# Altium schematic sheet 8161芯片-FSK调试板V1.28.SchDoc
size A4
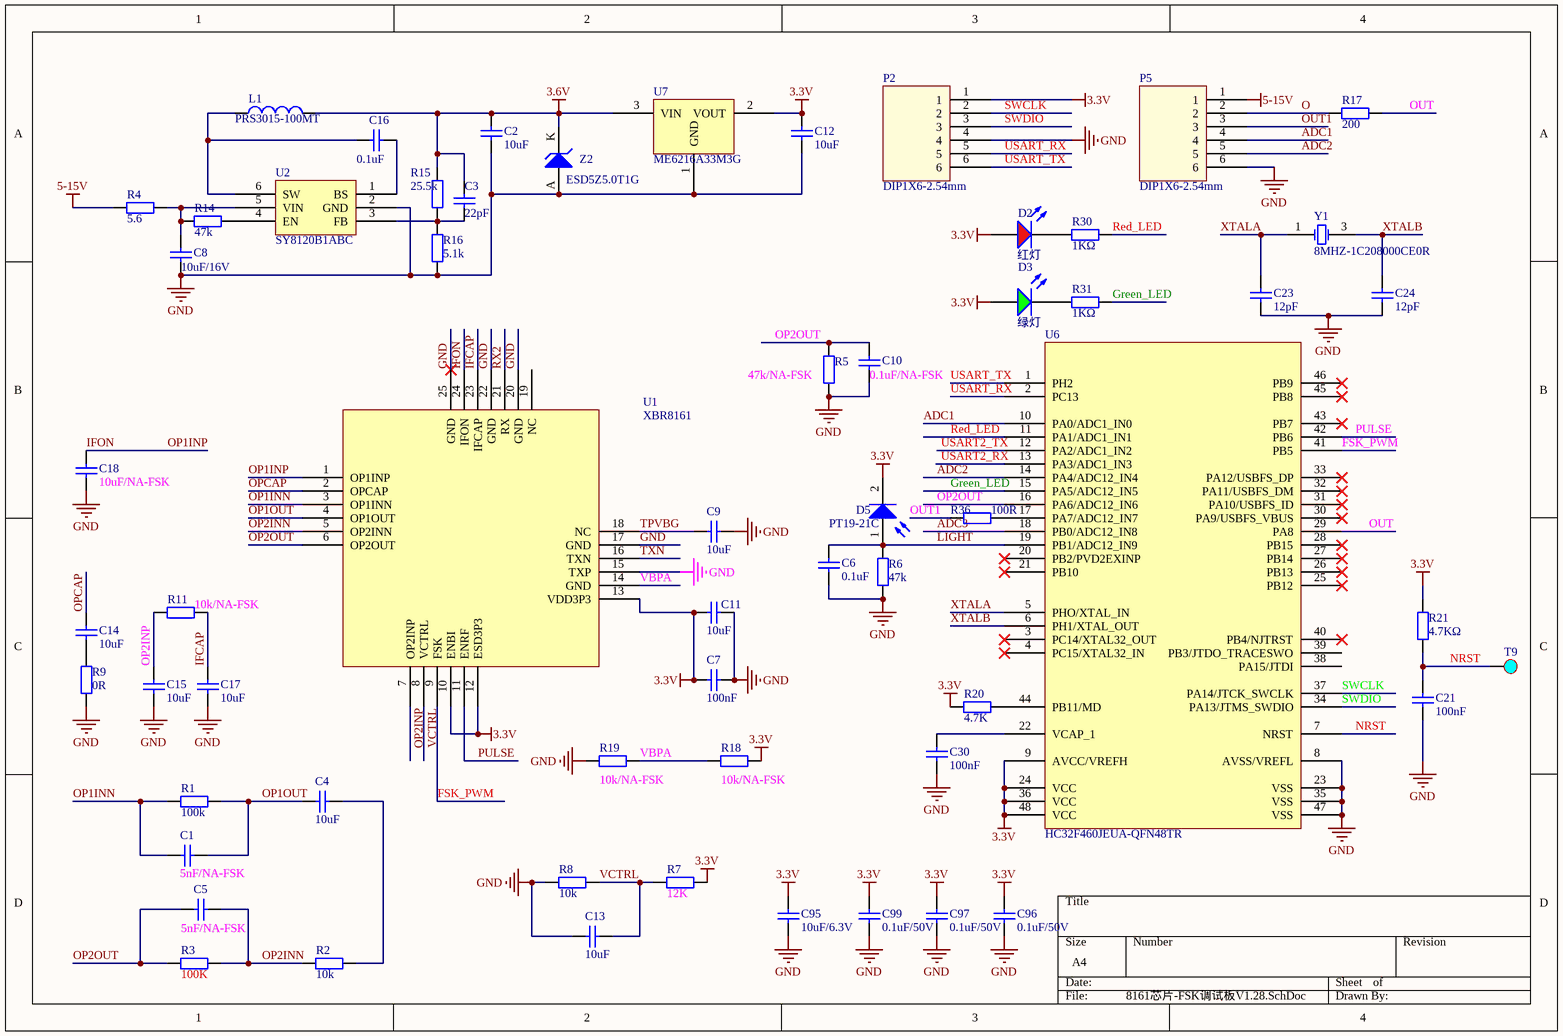
[diagram p0: 8161芯片-FSK调试板V1.28.SchDoc]

## Parts
C1  5nF/NA-FSK  [C0402]
C2  10uF  [C0402]
C3  22pF  [C0402]
C4  10uF  [C0402]
C5  5nF/NA-FSK  [C0402]
C6  0.1uF  [C0402]
C7  100nF  [C0402]
C8  10uF/16V  [C0603]
C9  10uF  [C0402]
C10  0.1uF/NA-FSK  [C0402]
C11  10uF  [C0402]
C12  10uF  [C0402]
C13  10uF  [C0402]
C14  10uF  [C0402]
C15  10uF  [C0402]
C16  0.1uF  [C0402]
C17  10uF  [C0402]
C18  10uF/NA-FSK  [C0402]
C21  100nF  [C0402]
C23  12pF  [C0402]
C24  12pF  [C0402]
C30  100nF  [C0402]
C95  10uF/6.3V  [C0402]
C96  0.1uF/50V  [C0402]
C97  0.1uF/50V  [C0402]
C99  0.1uF/50V  [C0402]
D2  红灯  [LC-0603_LED_S1]
D3  绿灯  [LC-0603_LED_S1]
D5  PT19-21C  [LED-0603]
L1  PRS3015-100MT  [PRS3015]
P2  DIP1X6-2.54mm  [DIP1X6-2.54]
P5  DIP1X6-2.54mm  [DIP1X6-2.54]
R1  100k  [R0402]
R2  10k  [R0402]
R3  100K  [R0402]
R4  5.6  [R0402]
R5  47k/NA-FSK  [R0402]
R6  47k  [R0402]
R7  12K  [R0402]
R8  10k  [R0402]
R9  0R  [R0402]
R11  10k/NA-FSK  [R0402]
R14  47k  [R0402]
R15  25.5k  [R0402]
R16  5.1k  [R0402]
R17  200  [R0402]
R18  10k/NA-FSK  [R0402]
R19  10k/NA-FSK  [R0402]
R20  4.7K  [R0402]
R21  4.7KΩ  [R0402]
R30  1KΩ  [R0402]
R31  1KΩ  [R0402]
R36  100R  [R0402]
T9  (no value)  [TestPoints]
U1  XBR8161  [QFN24]
U2  SY8120B1ABC  [SOT-23-6]
U6  HC32F460JEUA-QFN48TR  [QFN48-5X5mm]
U7  ME6216A33M3G  [SOT-23-L]
Y1  8MHZ-1C208000CE0R  [OSC-SMD_3225]
Z2  ESD5Z5.0T1G  [SOD323]

## Nets
3.3V: C7.2 C11.2 C12.1 C95.1 C96.1 C97.1 C99.1 D2.A D3.A D5.2(K) P2.1 R7.1 R18.1 R20.1 R21.2 U1.10(ENBI) U1.12(ESD3P3) U1.13(VDD3P3) U6.9(AVCC/VREFH) U6.24(VCC) U6.36(VCC) U6.48(VCC) U7.2(VOUT)
3.6V: C2.1 C3.2 L1.2 R15.2 U7.3(VIN) Z2.K
5-15V: P5.1 R4.1
GND: C2.2 C6.2 C7.1 C8.2 C9.1 C10.2 C11.1 C12.2 C13.2 C15.2 C17.1 C18.1 C21.1 C23.1 C24.1 C30.2 C95.2 C96.2 C97.2 C99.2 P2.4 P5.6 R5.2 R6.2 R8.2 R9.2 R16.1 R19.2 U1.15(TXP) U1.17(GND) U1.20(GND) U1.22(GND) U1.25(GND) U2.2(GND) U6.8(AVSS/VREFL) U6.23(VSS) U6.35(VSS) U6.47(VSS) U7.1(GND) Z2.A
ADC1: P5.4 U6.10(PA0/ADC1_IN0)
ADC2: P5.5 U6.14(PA4/ADC12_IN4)
ADC3: U6.18(PB0/ADC12_IN8)
FSK_PWM: U1.9(FSK) U6.41(PB5)
Green_LED: R31.1 U6.15(PA5/ADC12_IN5)
IFCAP: C17.2 R11.1 U1.23(IFCAP)
IFON: C18.2 U1.1(OP1INP) U1.24(IFON)  [also labelled OP1INP]
LIGHT: C6.1 D5.1(A) R6.1 U6.19(PB1/ADC12_IN9)
NRST: C21.2 R21.1 T9.1 U6.7(NRST)
O: P5.2 R17.1
OP1INN: C1.2 R1.1 U1.3(OP1INN)
OP1OUT: C1.1 C4.2 R1.2 U1.4(OP1OUT)
OP2INN: C5.2 R2.2 R3.1 U1.5(OP2INN)
OP2INP: C15.1 R11.2 U1.7(OP2INP)
OP2OUT: C5.1 C10.1 R3.2 R5.1 U1.6(OP2OUT) U6.16(PA6/ADC12_IN6)
OPCAP: C14.2 U1.2(OPCAP)
OUT: R17.2 U6.29(PA8)
OUT1: P5.3 R36.2
PULSE: U1.11(ENRF) U6.42(PB6)
Red_LED: R30.1 U6.11(PA1/ADC1_IN1)
RX2: U1.21(RX)
SWCLK: P2.2 U6.37(PA14/JTCK_SWCLK)
SWDIO: P2.3 U6.34(PA13/JTMS_SWDIO)
TPVBG: C9.2 U1.18(NC)
TXN: U1.16(TXN)
USART2_RX: U6.13(PA3/ADC1_IN3)
USART2_TX: U6.12(PA2/ADC1_IN2)
USART_RX: P2.5 U6.2(PC13)
USART_TX: P2.6 U6.1(PH2)
VBPA: R18.2 R19.1 U1.14(GND)
VCTRL: C13.1 R7.2 R8.1 U1.8(VCTRL)
XTALA: C23.2 U6.5(PHO/XTAL_IN) Y1.1(OSC1)
XTALB: C24.2 U6.6(PH1/XTAL_OUT) Y1.3(OSC2)
NetC3_1: C3.1 R15.1 R16.2 U2.3(FB)
NetC4_1: C4.1 R2.1
NetC8_1: C8.1 R4.2 R14.2 U2.5(VIN)
NetC14_1: C14.1 R9.1
NetC16_1: C16.1 L1.1 U2.6(SW)
NetC16_2: C16.2 U2.1(BS)
NetC30_1: C30.1 U6.22(VCAP_1)
NetD2_K: D2.K R30.2
NetD3_K: D3.K R31.2
NetR14_1: R14.1 U2.4(EN)
NetR20_2: R20.2 U6.44(PB11/MD)
NetR36_1: R36.1 U6.17(PA7/ADC12_IN7)

Not connected (* = marked no-connect by the designer): U1 19(NC); U6 3(PC14/XTAL32_OUT)* 4(PC15/XTAL32_IN)* 20(PB2/PVD2EXINP)* 21(PB10)* 25(PB12)* 26(PB13)* 27(PB14)* 28(PB15)* 30(PA9/USBFS_VBUS)* 31(PA10/USBFS_ID)* 32(PA11/USBFS_DM)* 33(PA12/USBFS_DP)* 38(PA15/JTDI) 39(PB3/JTDO_TRACESWO) 40(PB4/NJTRST)* 43(PB7)* 45(PB8)* 46(PB9)*

## Library data of the parts
C1-C18 C30 = Cap: Capacitor; Published: 8-Jun-2000; LatestRevisionDate: 17-Jul-2002; LatestRevisionNote: Re-released for DXP Platform.; PackageReference: RAD-0.3; Publisher: Altium Limited; PackageDescription: Radial Cap, Thru-Hole; 2 Leads; 0.3 in Pin Spacing
  C1 C5: Value: 5nF/NA-FSK
  C2 C4 C9 C11-C15 C17: Value: 10uF
  C3: Value: 22pF
  C6 C16: Value: 0.1uF
  C7 C30: Value: 100nF
  C8: Value: 10uF/16V
  C10: Value: 0.1uF/NA-FSK
  C18: Value: 10uF/NA-FSK
C21 = 0402 100nF (104) 10% 16V: 贴片电容; ComponentLink1Description: 供应商链接; ComponentLink1URL: http://www.szlcsc.com/product/details_1877.html; Package: 0402; Supplier: LC; SuppliersPartNumber: C1525
C23 C24 = 0402 22pF (220) 5% 50V: 贴片电容; ComponentLink1Description: 供应商链接; ComponentLink1URL: http://www.szlcsc.com/product/details_1907.html; Package: 0402; Supplier: LC; SuppliersPartNumber: C1555
C95-C97 C99 = 0402 2.2nF (222) 10% 50V: 贴片电容; ComponentLink1Description: 供应商链接; ComponentLink1URL: http://www.szlcsc.com/product/details_1883.html; Package: 0402; Supplier: LC; SuppliersPartNumber: C1531
D2 D3 = 0603 红灯: 发光二极管; ComponentLink1Description: 供应商链接; ComponentLink1URL: http://www.szlcsc.com/product/details_2659.html; Package: 0603; Supplier: LC; SuppliersPartNumber: C2286
D5 = Photo Sen: Photosensitive Diode; Published: 24-Mar-1999; LatestRevisionDate: 17-Jul-2002; LatestRevisionNote: Re-released for DXP Platform.; PackageReference: PIN2; Publisher: Altium Limited; Value: PT19-21C
L1 = Inductor: Code_IEC: 1005; Published: 8-Jun-2000; LatestRevisionDate: 29-May-2009; LatestRevisionNote: IPC-7351 Footprint Added.; PackageReference: 0402-A; Publisher: Altium Limited; PackageDescription: Chip Inductor; Code_JEITA: 0402; Value: PRS3015-100MT
R1-R9 R11 R14-R20 = Res2: Resistor; Published: 8-Jun-2000; LatestRevisionDate: 17-Jul-2002; LatestRevisionNote: Re-released for DXP Platform.; PackageReference: AXIAL-0.4; Publisher: Altium Limited
  R1: PackageDescription: Axial Device, Thru-Hole; 2 Leads; 0.4 in Pin Spacing; Value: 100k
  R2 R8: PackageDescription: Axial Device, Thru-Hole; 2 Leads; 0.4 in Pin Spacing; Value: 10k
  R3: PackageDescription: Axial Device, Thru-Hole; 2 Leads; 0.4 in Pin Spacing; Value: 100K
  R4: Value: 5.6
  R5: PackageDescription: Axial Device, Thru-Hole; 2 Leads; 0.4 in Pin Spacing; Value: 47k/NA-FSK
  R6 R14: PackageDescription: Axial Device, Thru-Hole; 2 Leads; 0.4 in Pin Spacing; Value: 47k
  R7: PackageDescription: Axial Device, Thru-Hole; 2 Leads; 0.4 in Pin Spacing; Value: 12K
  R9: PackageDescription: Axial Device, Thru-Hole; 2 Leads; 0.4 in Pin Spacing; Value: 0R
  R11 R18 R19: PackageDescription: Axial Device, Thru-Hole; 2 Leads; 0.4 in Pin Spacing; Value: 10k/NA-FSK
  R15: PackageDescription: Axial Device, Thru-Hole; 2 Leads; 0.4 in Pin Spacing; Value: 25.5k
  R16: PackageDescription: Axial Device, Thru-Hole; 2 Leads; 0.4 in Pin Spacing; Value: 5.1k
  R17: PackageDescription: Axial Device, Thru-Hole; 2 Leads; 0.4 in Pin Spacing; Value: 200
  R20: PackageDescription: Axial Device, Thru-Hole; 2 Leads; 0.4 in Pin Spacing; Value: 4.7K
R21 R36 = 0402 4.7KΩ (4701) 1%: 贴片电阻; ComponentLink1Description: 供应商链接; ComponentLink1URL: http://www.szlcsc.com/product/details_26643.html; Package: 0402; Supplier: LC; SuppliersPartNumber: C25900
R30 R31 = 0402 1KΩ (1001) 1%: 贴片电阻; ComponentLink1Description: 供应商链接; ComponentLink1URL: http://www.szlcsc.com/product/details_12256.html; Package: 0402; Supplier: LC; SuppliersPartNumber: C11702
T9 = TestPoints
U2 = H9108
U6 = HC32F460JETA-LQFP48
U7 = SSP6206
Y1 = SMD-3225_4P  25MHZ 12PF 10PPM: 贴片晶振; ComponentLink1Description: 供应商链接; ComponentLink1URL: http://www.szlcsc.com/product/details_9526.html; Package: SMD-3225_4P; Supplier: LC; SuppliersPartNumber: C9006
Z2 = D Zener: Zener Diode; Published: 8-Jun-2000; LatestRevisionDate: 17-Jul-2002; LatestRevisionNote: Re-released for DXP Platform.; PackageReference: DIODE-0.7; Publisher: Altium Limited; PackageDescription: Diode, Thru-Hole; 2 Leads; 0.7 in Pin Spacing